# Altium project Temperature Sensor.PrjPcb (part 1 of 2)
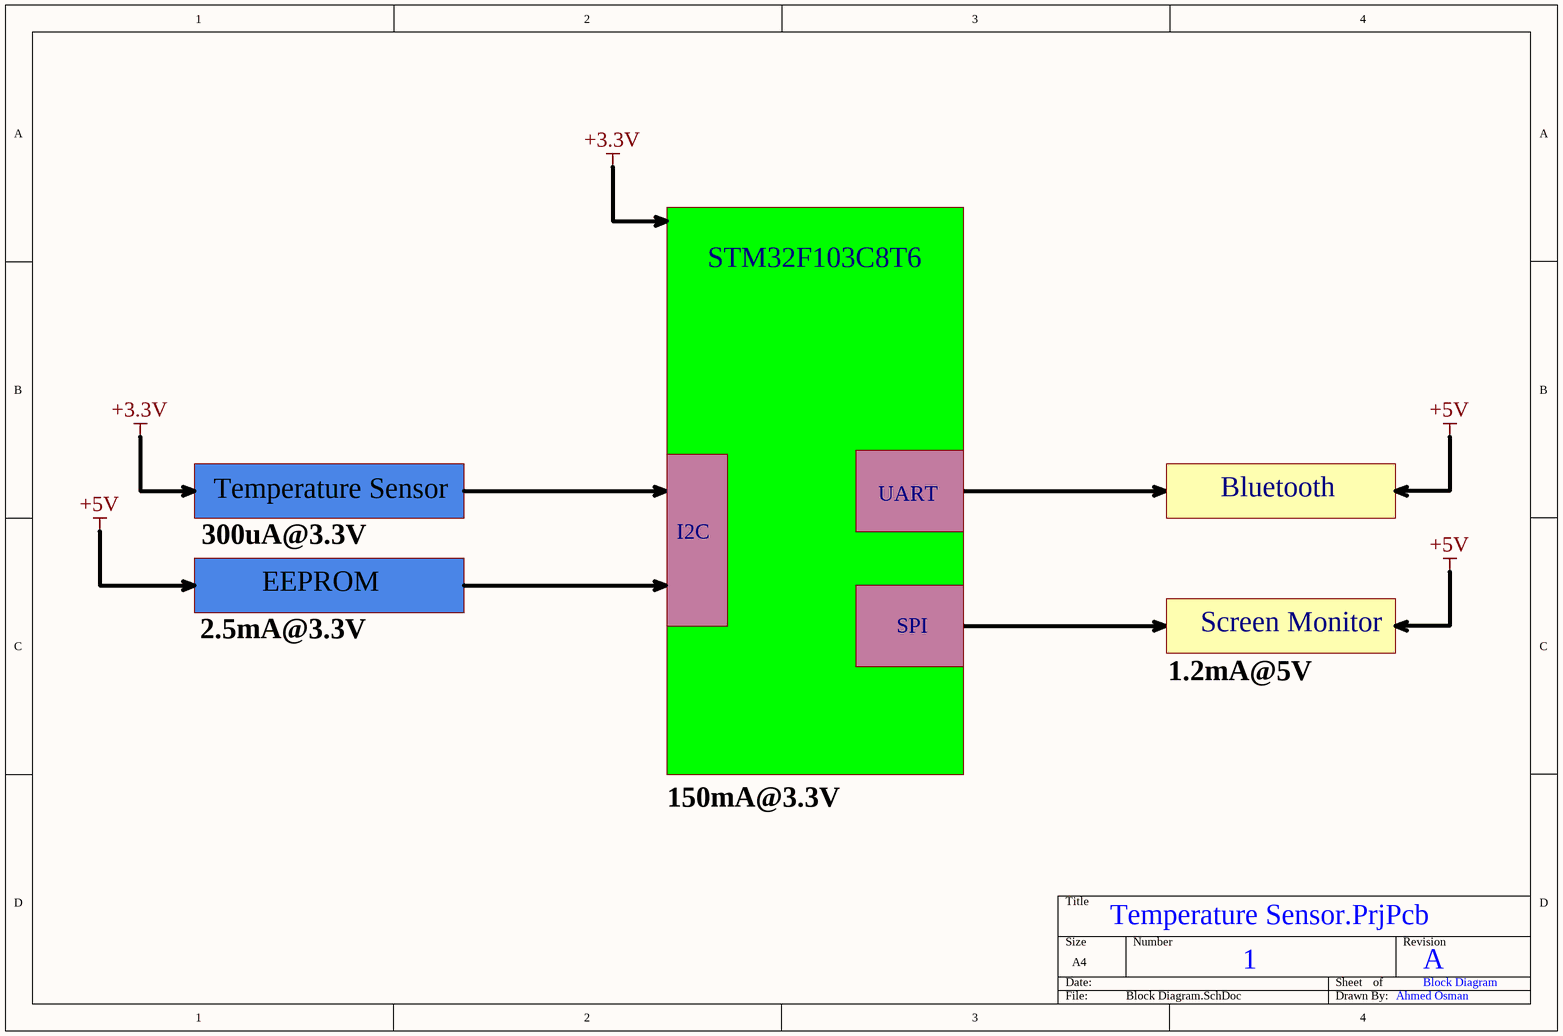
[diagram p0: Block Diagram.SchDoc]
Author: Ahmed Osman; Revision: A
6 sheets, 63 parts. Net scope: flat (ports and power ports of the same name join across sheets).
Board file: PCB.PcbDoc
Sheets:
  Block Diagram.SchDoc
  Power Conversion.SchDoc
  Buck Converter and LDO.SchDoc
  MCU_.SchDoc
  EEPROM and Temperature Sensor.SchDoc
  Bluetooth and OLED Display.SchDoc

## Sheet Block Diagram.SchDoc
size A4

### Notes on the sheet
- STM32F103C8T6
- Temperature Sensor
- UART
- Bluetooth
- 300uA@3.3V
- I2C
- 2.5mA@3.3V
- EEPROM
- SPI
- Screen Monitor
- 1.2mA@5V
- 150mA@3.3V
- 1
- A
- Block Diagram
- Ahmed Osman
- Labels drawn without touching a wire or pin: +3.3V, +5V

## Sheet Power Conversion.SchDoc
size A4
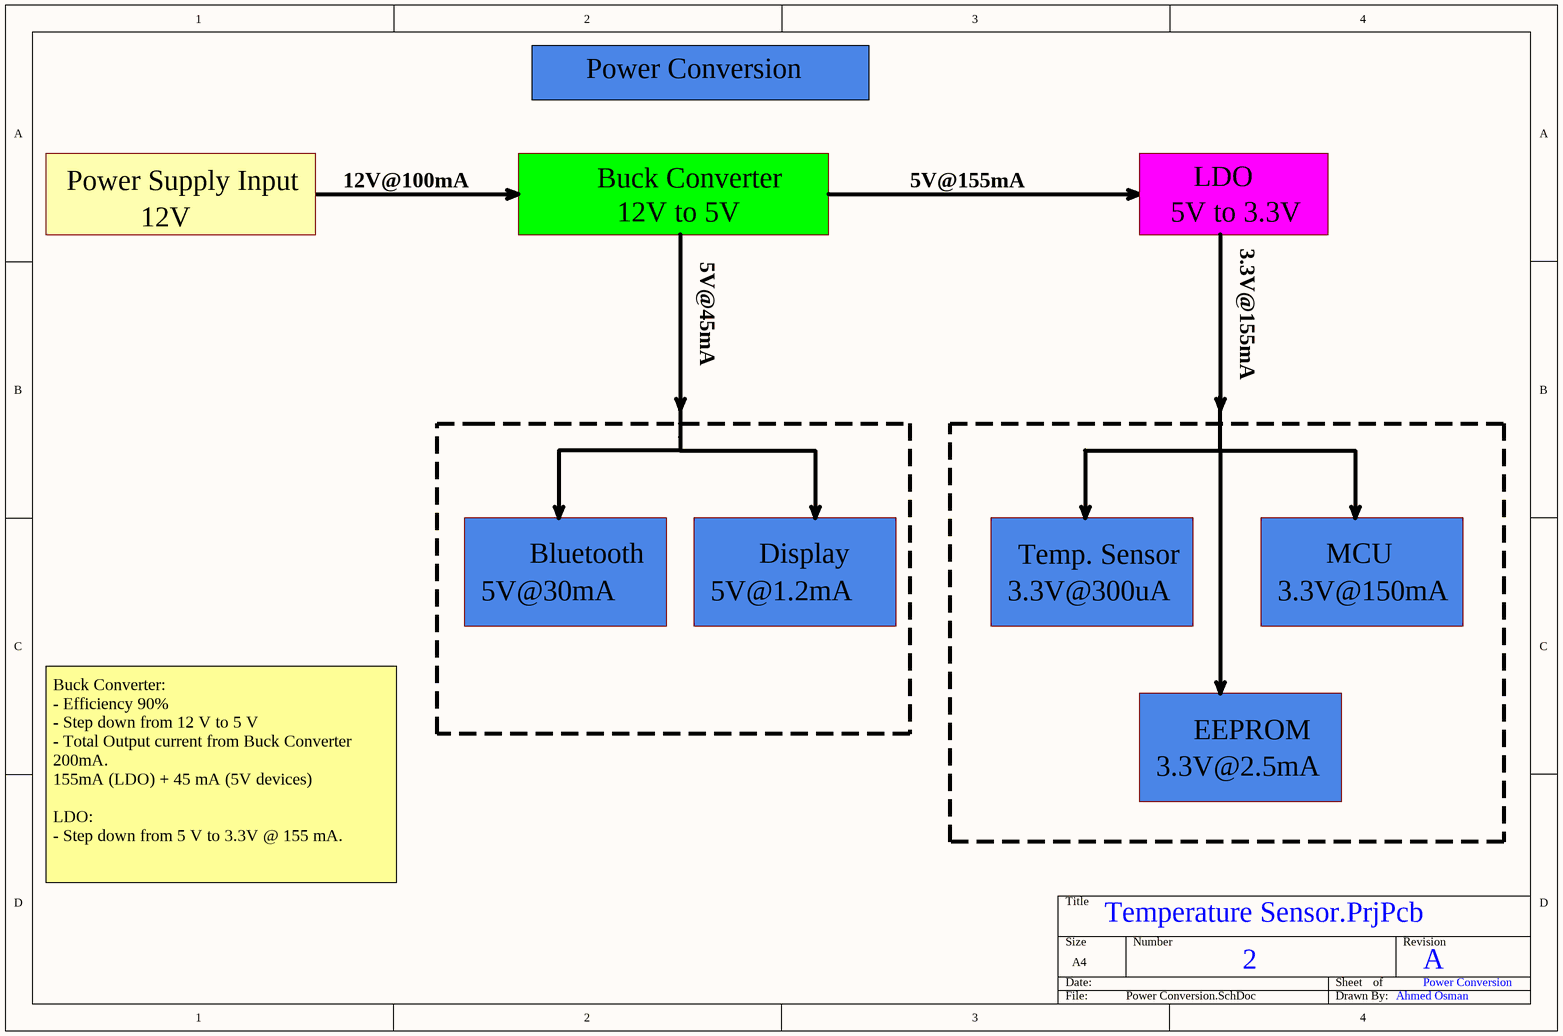
[diagram p1: Power Conversion.SchDoc]

### Notes on the sheet
- Power Conversion
- Power Supply Input
- 12V
- 12V@100mA
- Buck Converter
- 12V to 5V
- 5V@155mA
- 5V to 3.3V
- LDO
- 3.3V@155mA
- 5V@45mA
- Bluetooth
- Display
- Temp. Sensor
- MCU
- 5V@30mA
- 5V@1.2mA
- 3.3V@300uA
- 3.3V@150mA
- 3.3V@2.5mA
- EEPROM
- Buck Converter:
  - Efficiency 90%
  - Step down from 12 V to 5 V
  - Total Output current from Buck Converter 200mA.
  155mA (LDO) + 45 mA (5V devices)
  LDO:
  - Step down from 5 V to 3.3V @ 155 mA.
- 2
- A
- Ahmed Osman

## Sheet Buck Converter and LDO.SchDoc
size A4
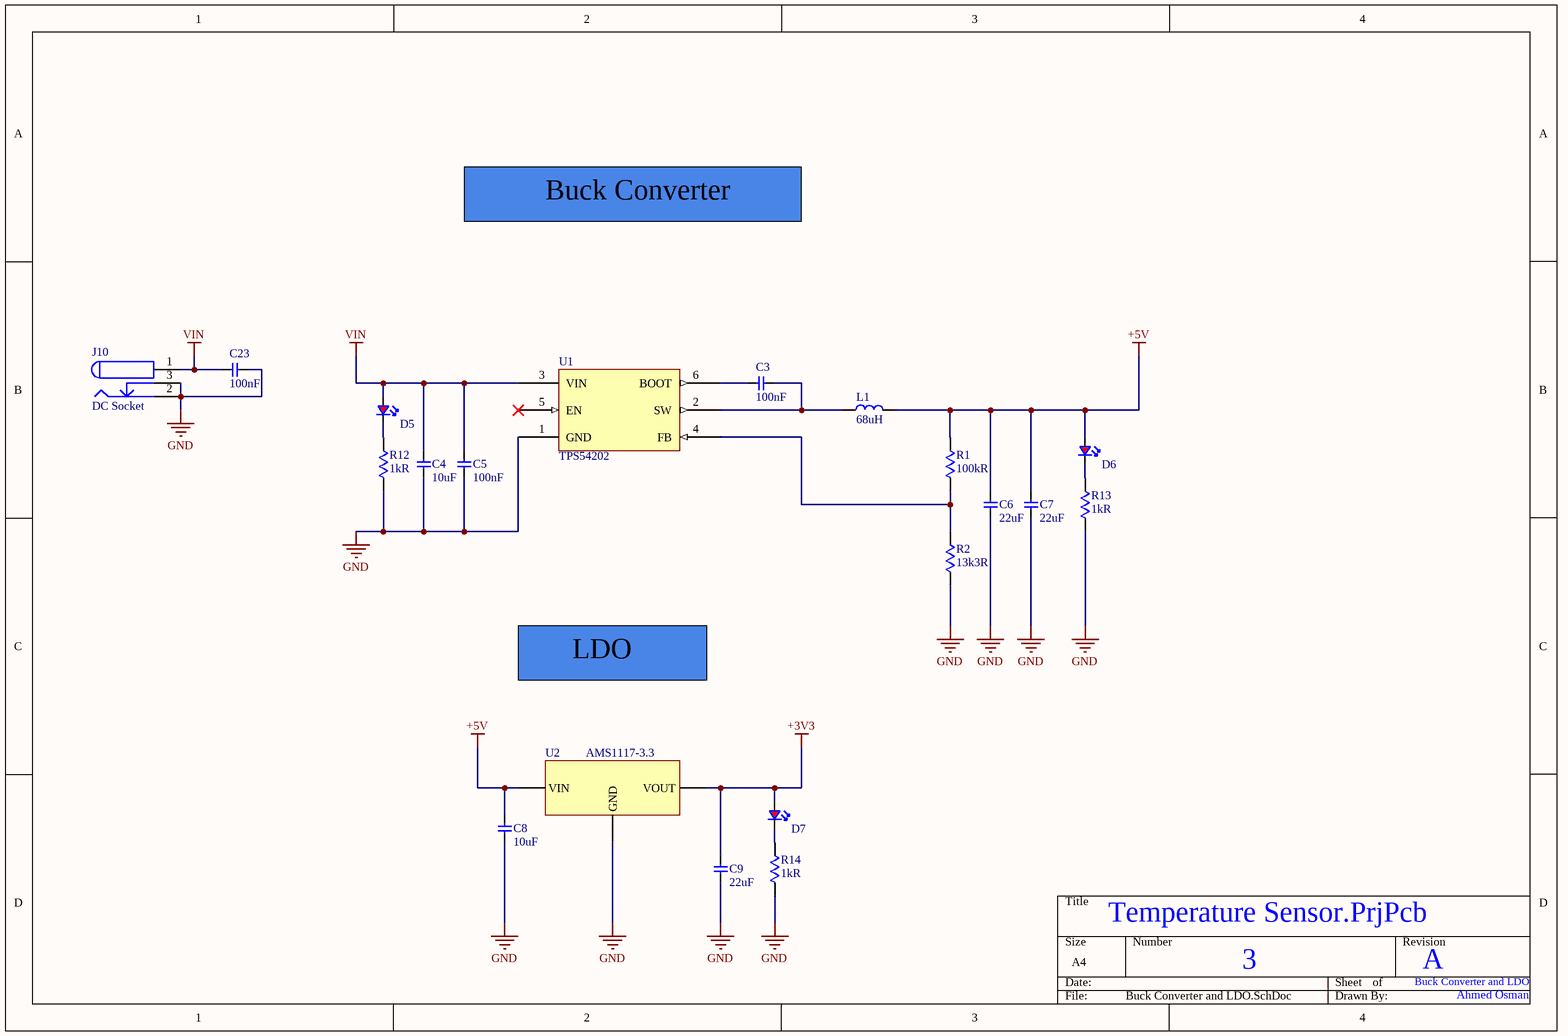
[diagram p2: Buck Converter and LDO.SchDoc]

### Parts
C3  100nF  [CAP 0603]
C4  10uF  [CAP 0603]
C5  100nF  [CAP 0603]
C6  22uF  [CAP 0603]
C7  22uF  [CAP 0603]
C8  10uF  [CAP 0603]
C9  22uF  [CAP 0603]
C23  100nF  [CAP 0603]
D5  LED RED  [LED RED]  (value not drawn)
D6  LED RED  [LED RED]  (value not drawn)
D7  LED RED  [LED RED]  (value not drawn)
J10  DC Socket  [DC Socket]
L1  68uH  [Inductor SMD,12.3x12.3mm]
R1  100kR  [RES 0603]
R2  13k3R  [RES 0603]
R12  1kR  [RES 0603]
R13  1kR  [RES 0603]
R14  1kR  [RES 0603]
U1  TPS54202  [SOT-23-6]
U2  AMS1117-3.3  [SOT-223-3L]

### Nets
+3V3: C9.2 D7.2 U2.2(VOUT)
+5V: C6.2 C7.2 C8.2 D6.2 L1.2 R1.2 U2.3(VIN)
GND: C4.2 C5.1 C6.1 C7.1 C8.1 C9.1 C23.2 J10.2(GND) J10.3(GND) R2.2 R12.1 R13.1 R14.1 U1.1(GND) U2.1(GND)
VIN: C4.1 C5.2 C23.1 D5.2 J10.1(VIN) U1.3(VIN)
NetC3_1: C3.1 U1.6(BOOT)
NetC3_2: C3.2 L1.1 U1.2(SW)
NetD5_1: D5.1 R12.2
NetD6_1: D6.1 R13.2
NetD7_1: D7.1 R14.2
NetR1_1: R1.1 R2.1 U1.4(FB)

Not connected (* = marked no-connect by the designer): U1 5(EN)*

### Notes on the sheet
- Buck Converter
- LDO
- 3
- Buck Converter and LDO
- A
- Ahmed Osman

### Library data of the parts
C3 C5 = CAP  0603 100nF 10% 50 V: 0.1 µF ±10% 50V Ceramic Capacitor X7R 0603 (1608 Metric); Manufacturer 1: Samsung; Manufacturer Part Number 1: CL10B104KB8NNNC; Supplier 1: Digikey; Stock 1: 6418947; Pricing 1: 4000 = 0.00562, 8000 = 0.00513, 12000 = 0.00489, 28000 = 0.00464, 100000 = 0.00336, 200000 = 0.00325, 400000 = 0.00306 (USD); RoHS: Yes; Mount: Surface Mount; Case/Package: 0603; Case Code (Metric): 1608; Case Code (Imperial): 0603; Material: Ceramic; Min Operating Temperature: -55°C; Max Operating Temperature: 125°C; Capacitance: 100nF; Tolerance: 10%; Dielectric: X7R; Voltage: 50V; Voltage Rating (DC): 50V; Voltage Rating: 50V; Package Quantity: 1; Packaging: Tape and Reel; Series: CL; Construction: Flat; Length: 1.6mm; Width: 0.031inch; Height: 0.8mm; Depth: 0.8mm; Thickness: 0.035inch; Radiation Hardening: No; Lead Free: Lead Free; RoHS Compliant: Yes; ComponentLink1URL: https://datasheet.ciiva.com/25803/cl10b104kb8nnnc-25803393.pdf?src-supplier=Digikey; ComponentLink1Description: https://datasheet.ciiva.com/25803/cl10b104kb8nnnc-25803393.pdf?src-supplier=Digikey; ComponentLink2URL: https://datasheet.ciiva.com/26838/getdatasheetpartid-89097-26838411.pdf?src-supplier=Verical; ComponentLink2Description: https://datasheet.ciiva.com/26838/getdatasheetpartid-89097-26838411.pdf?src-supplier=Verical; ComponentLink3URL: https://datasheet.ciiva.com/29198/456651-da-01-en-vs-kondensator-0605-29198839.pdf?src-supplier=Conrad; ComponentLink3Description: https://datasheet.ciiva.com/29198/456651-da-01-en-vs-kondensator-0605-29198839.pdf?src-supplier=Conrad; Supplier Part Number 1: 1276-1000-2-ND; value: 100nF; Manufacturer 2: Samsung; Manufacturer Part Number 2: CL10B104KB8NNNC; Supplier 2: LCSC; Supplier Part Number 2: C1591
C4 = CAP 0603 10 µF ±20% 35V _1: 10 µF ±20% 35V Ceramic Capacitor X5R 0603 (1608 Metric); Manufacturer: Murata; Manufacturer Part Number: GRM188R6YA106MA73D; Supplier 1: Digikey; Stock 1: 432618; Pricing 1: 1 = 0.3, 10 = 0.172, 50 = 0.123, 100 = 0.1077, 500 = 0.0818, 1000 = 0.07373 (USD); RoHS: Yes; Mount: Surface Mount; Case/Package: 0603; Case Code (Metric): 1608; Case Code (Imperial): 0603; Material: Ceramic; Min Operating Temperature: -55°C; Max Operating Temperature: 85°C; Packaging: Cut Tape; Capacitance: 10uF; Voltage Rating: 35V; Tolerance: 20%; Voltage Rating (DC): 35V; Dielectric: X5R; Series: GRM; Length: 0.063inch; Width: 0.031inch; Height: 1mm; Thickness: 0.039inch; RoHS Compliant: Yes; ComponentLink1URL: http://search.murata.co.jp/Ceramy/image/img/A01X/G101/ENG/GRM188R6YA106MA73-01.pdf?src-supplier=Digikey; ComponentLink1Description: http://search.murata.co.jp/Ceramy/image/img/A01X/G101/ENG/GRM188R6YA106MA73-01.pdf?src-supplier=Digikey; ComponentLink2URL: https://www.murata.com/~/media/webrenewal/support/library/catalog/products/capacitor/mlcc/c02e.ashx?la=en-us&src-supplier=Digikey; ComponentLink2Description: https://www.murata.com/~/media/webrenewal/support/library/catalog/products/capacitor/mlcc/c02e.ashx?la=en-us&src-supplier=Digikey; ComponentLink3URL: https://datasheet.octopart.com/GRM188R6YA106MA73D-Murata-datasheet-86813743.pdf?src-supplier=Future+Electronics; ComponentLink3Description: https://datasheet.octopart.com/GRM188R6YA106MA73D-Murata-datasheet-86813743.pdf?src-supplier=Future+Electronics; ComponentLink4URL: https://datasheet.octopart.com/GRM188R6YA106MA73D-Murata-datasheet-149523261.pdf?src-supplier=Newark; ComponentLink4Description: https://datasheet.octopart.com/GRM188R6YA106MA73D-Murata-datasheet-149523261.pdf?src-supplier=Newark; ComponentLink5URL: http://search.murata.co.jp/Ceramy/image/img/A01X/G101/ENG/GRM188R6YA106MA73-01.pdf?src-supplier=Mouser; ComponentLink5Description: http://search.murata.co.jp/Ceramy/image/img/A01X/G101/ENG/GRM188R6YA106MA73-01.pdf?src-supplier=Mouser; ComponentLink6URL: http://search.murata.co.jp/Ceramy/image/img/A01X/G101/ENG/GRM188R6YA106MA73-01.pdf?src-supplier=Future+Electronics; ComponentLink6Description: http://search.murata.co.jp/Ceramy/image/img/A01X/G101/ENG/GRM188R6YA106MA73-01.pdf?src-supplier=Future+Electronics; ComponentLink7URL: http://search.murata.co.jp/Ceramy/image/img/A01X/G101/ENG/GRM188R6YA106MA73-01.pdf?src-supplier=TTI; ComponentLink7Description: http://search.murata.co.jp/Ceramy/image/img/A01X/G101/ENG/GRM188R6YA106MA73-01.pdf?src-supplier=TTI; ComponentLink8URL: https://datasheet.octopart.com/GRM188R6YA106MA73D-Murata-datasheet-165579666.pdf?src-supplier=TME; ComponentLink8Description: https://datasheet.octopart.com/GRM188R6YA106MA73D-Murata-datasheet-165579666.pdf?src-supplier=TME; Supplier Part Number 1: 490-13248-1-ND; Supplier Part Number 2: C194427; Supplier 2: LCSC; value: 10uF
C6 C7 C9 = CAP  0603 22 µF ±20% 10V: 10V 22uF X5R ±20% 0603 Multilayer Ceramic Capacitors MLCC - SMD/SMT ROHS; Supplier 2: LCSC; Supplier Part Number 2: C86295; value: 22uF; Manufacturer 2: Samsung Electro-Mechanics; Manufacturer Part Number 2: CL10A226MP8NUNE
C8 = CAP 0603 10 µF ±20% 35V: 10 µF ±20% 35V Ceramic Capacitor X5R 0603 (1608 Metric); Manufacturer: Murata; Manufacturer Part Number: GRM188R6YA106MA73D; Supplier 1: Digikey; Stock 1: 432618; Pricing 1: 1 = 0.3, 10 = 0.172, 50 = 0.123, 100 = 0.1077, 500 = 0.0818, 1000 = 0.07373 (USD); RoHS: Yes; Mount: Surface Mount; Case/Package: 0603; Case Code (Metric): 1608; Case Code (Imperial): 0603; Material: Ceramic; Min Operating Temperature: -55°C; Max Operating Temperature: 85°C; Packaging: Cut Tape; Capacitance: 10uF; Voltage Rating: 35V; Tolerance: 20%; Voltage Rating (DC): 35V; Dielectric: X5R; Series: GRM; Length: 0.063inch; Width: 0.031inch; Height: 1mm; Thickness: 0.039inch; RoHS Compliant: Yes; ComponentLink1URL: http://search.murata.co.jp/Ceramy/image/img/A01X/G101/ENG/GRM188R6YA106MA73-01.pdf?src-supplier=Digikey; ComponentLink1Description: http://search.murata.co.jp/Ceramy/image/img/A01X/G101/ENG/GRM188R6YA106MA73-01.pdf?src-supplier=Digikey; ComponentLink2URL: https://www.murata.com/~/media/webrenewal/support/library/catalog/products/capacitor/mlcc/c02e.ashx?la=en-us&src-supplier=Digikey; ComponentLink2Description: https://www.murata.com/~/media/webrenewal/support/library/catalog/products/capacitor/mlcc/c02e.ashx?la=en-us&src-supplier=Digikey; ComponentLink3URL: https://datasheet.octopart.com/GRM188R6YA106MA73D-Murata-datasheet-86813743.pdf?src-supplier=Future+Electronics; ComponentLink3Description: https://datasheet.octopart.com/GRM188R6YA106MA73D-Murata-datasheet-86813743.pdf?src-supplier=Future+Electronics; ComponentLink4URL: https://datasheet.octopart.com/GRM188R6YA106MA73D-Murata-datasheet-149523261.pdf?src-supplier=Newark; ComponentLink4Description: https://datasheet.octopart.com/GRM188R6YA106MA73D-Murata-datasheet-149523261.pdf?src-supplier=Newark; ComponentLink5URL: http://search.murata.co.jp/Ceramy/image/img/A01X/G101/ENG/GRM188R6YA106MA73-01.pdf?src-supplier=Mouser; ComponentLink5Description: http://search.murata.co.jp/Ceramy/image/img/A01X/G101/ENG/GRM188R6YA106MA73-01.pdf?src-supplier=Mouser; ComponentLink6URL: http://search.murata.co.jp/Ceramy/image/img/A01X/G101/ENG/GRM188R6YA106MA73-01.pdf?src-supplier=Future+Electronics; ComponentLink6Description: http://search.murata.co.jp/Ceramy/image/img/A01X/G101/ENG/GRM188R6YA106MA73-01.pdf?src-supplier=Future+Electronics; ComponentLink7URL: http://search.murata.co.jp/Ceramy/image/img/A01X/G101/ENG/GRM188R6YA106MA73-01.pdf?src-supplier=TTI; ComponentLink7Description: http://search.murata.co.jp/Ceramy/image/img/A01X/G101/ENG/GRM188R6YA106MA73-01.pdf?src-supplier=TTI; ComponentLink8URL: https://datasheet.octopart.com/GRM188R6YA106MA73D-Murata-datasheet-165579666.pdf?src-supplier=TME; ComponentLink8Description: https://datasheet.octopart.com/GRM188R6YA106MA73D-Murata-datasheet-165579666.pdf?src-supplier=TME; Supplier Part Number 1: 490-13248-1-ND; Supplier Part Number 2: C194427; Supplier 2: LCSC; value: 10uF
C23 = CAP  0603 100 nF 10% 50 V: 0.1 µF ±10% 50V Ceramic Capacitor X7R 0603 (1608 Metric); Manufacturer 1: Samsung; Manufacturer Part Number 1: CL10B104KB8NNNC; Supplier 1: Digikey; Stock 1: 6418947; Pricing 1: 4000 = 0.00562, 8000 = 0.00513, 12000 = 0.00489, 28000 = 0.00464, 100000 = 0.00336, 200000 = 0.00325, 400000 = 0.00306 (USD); RoHS: Yes; Mount: Surface Mount; Case/Package: 0603; Case Code (Metric): 1608; Case Code (Imperial): 0603; Material: Ceramic; Min Operating Temperature: -55°C; Max Operating Temperature: 125°C; Capacitance: 100nF; Tolerance: 10%; Dielectric: X7R; Voltage: 50V; Voltage Rating (DC): 50V; Voltage Rating: 50V; Package Quantity: 1; Packaging: Tape and Reel; Series: CL; Construction: Flat; Length: 1.6mm; Width: 0.031inch; Height: 0.8mm; Depth: 0.8mm; Thickness: 0.035inch; Radiation Hardening: No; Lead Free: Lead Free; RoHS Compliant: Yes; ComponentLink1URL: https://datasheet.ciiva.com/25803/cl10b104kb8nnnc-25803393.pdf?src-supplier=Digikey; ComponentLink1Description: https://datasheet.ciiva.com/25803/cl10b104kb8nnnc-25803393.pdf?src-supplier=Digikey; ComponentLink2URL: https://datasheet.ciiva.com/26838/getdatasheetpartid-89097-26838411.pdf?src-supplier=Verical; ComponentLink2Description: https://datasheet.ciiva.com/26838/getdatasheetpartid-89097-26838411.pdf?src-supplier=Verical; ComponentLink3URL: https://datasheet.ciiva.com/29198/456651-da-01-en-vs-kondensator-0605-29198839.pdf?src-supplier=Conrad; ComponentLink3Description: https://datasheet.ciiva.com/29198/456651-da-01-en-vs-kondensator-0605-29198839.pdf?src-supplier=Conrad; Supplier Part Number 1: 1276-1000-2-ND; value: 100nF; Manufacturer 2: Samsung; Manufacturer Part Number 2: CL10B104KB8NNNC; Supplier 2: LCSC; Supplier Part Number 2: C1591
D5-D7 = LED RED: Red 625nm LED Indication - Discrete 2V 0603 (1608 Metric); Manufacturer 1: Wurth Electronics; Manufacturer Part Number 1: 150060RS75000; Lens Color: Colorless; Viewing Angle: 140°; Lens Style: Clear,Flat,Rectangular; Luminous Intensity: 250mcd; Forward Current: 30mA; Test Current: 20mA; Lens Transparency: Clear; Max Reverse Voltage (DC): 5V; Power Dissipation: 72mW; Lens Size: 0.7mm; Supplier 1: Digikey; Stock 1: 110901; Pricing 1: 1 = 0.15, 50 = 0.142, 100 = 0.122, 500 = 0.105, 1000 = 0.10125 (USD); RoHS: Yes; Mount: Surface Mount; Case/Package: 0603; Color: Red; Case Code (Metric): 1608; Case Code (Imperial): 0603; Min Operating Temperature: -40°C; Max Operating Temperature: 85°C; Package Quantity: 1; Packaging: Cut Tape; Forward Voltage: 2V; Wavelength: 625nm; Dominant Wavelength: 625nm; Series: WL-SMCW; Reverse Voltage: 5V; Length: 1.6mm; Width: 0.8mm; Height: 0.8mm; RoHS Compliant: Yes; Reach SVHC Compliant: Unknown; ComponentLink1URL: https://datasheet.ciiva.com/29563/150060rs75000-29563040.pdf?src-supplier=Digikey; ComponentLink1Description: https://datasheet.ciiva.com/29563/150060rs75000-29563040.pdf?src-supplier=Digikey; Supplier Part Number 1: 732-4978-1-ND; Supplier 2: LCSC; Supplier Part Number 2: C128251; Manufacturer 2: Everlight Elec; Manufacturer Part Number 2: 19-213/R6C-AN2Q1B/3T
J10 = DC Socket: Bend-in DC Power Receptacle -20℃~+70℃ 2.5mm 6.3mm 3A 30V Plugin DC Power Connectors ROHS; Supplier 2: LCSC; Supplier Part Number 2: C720558; Manufacturer 2: XUNPU; Manufacturer Part Number 2: DC-005-A250
L1 = IND  12.3x12.3mm 68uH ±20% 140mΩ_1: 2.1A 68uH ±20% 140mΩ SMD,12.3x12.3mm Inductors (SMD) ROHS; Manufacture: SHOU HAN; Manufacture Part Number: CYH127-68UH; Supplier 2: LCSC; Supplier Part Number 2: C2929504; value: 68uH
R1 = RES  0603 100KR 0.1% 1/10W: 100 kOhms ±0.1% 0.1W, 1/10W Chip Resistor 0603 (1608 Metric) Thin Film; Voltage Rating: 75V; Power Rating: 100mW; Temperature Coefficient: 25ppm/°C; Supplier 1: Digikey; Stock 1: 102412; Pricing 1: 1 = 0.14, 10 = 0.098, 50 = 0.0846, 100 = 0.0755, 500 = 0.0561, 1000 = 0.051 (USD); RoHS: Yes; Mount: Surface Mount; Case/Package: 0603; Case Code (Imperial): 0603; Case Code (Metric): 1608; Min Operating Temperature: -55°C; Max Operating Temperature: 155°C; Packaging: Tape and Reel; Tolerance: 0.1%; Resistance: 100kR; Package Quantity: 5000; Termination: SMD/SMT; Number of Terminations: 2; Max Power Dissipation: 100mW; Voltage Rating (DC): 75V; Features: Moisture Resistant; Series: RT; Technology: THIN FILM; Length: 0.063inch; Width: 0.031inch; Height: 0.022inch; Depth: 0.8mm; RoHS Compliant: Yes; Lead Free: 5697LeadFree; ComponentLink1URL: https://datasheet.ciiva.com/11819/0900766b8079c86e-11819622.pdf?src-supplier=Rs; ComponentLink1Description: https://datasheet.ciiva.com/11819/0900766b8079c86e-11819622.pdf?src-supplier=Rs; Supplier 2: LCSC; Supplier Part Number 2: C122538; Supplier Part Number 1: YAG1235CT-ND; value: 100kR; Manufacturer 2: Yageo; Manufacturer Part Number 2: RT0603BRD07100KL
R2 = RES  0603 13.3kR ±1% 0.1W: 13.3 kOhms ±1% 0.1W, 1/10W Chip Resistor 0603 (1608 Metric) Thin Film; Manufacturer: Yageo; Manufacturer Part Number 1: RT0603FRE0713K3L; Resistance: 13.3kR; Power Rating: 100mW; Voltage Rating: 75V; Temperature Coefficient: 50ppm/°C; Voltage Rating (DC): 50V; Supplier 1: Digikey; Stock 1: 26442; Pricing 1: 1 = 0.1, 10 = 0.018, 50 = 0.0158, 100 = 0.0128, 500 = 0.01224 (USD); RoHS: Yes; Case/Package: 0603; Case Code (Metric): 1608; Case Code (Imperial): 0603; Contact Plating: Tin,Matte; Min Operating Temperature: -55°C; Max Operating Temperature: 125°C; Package Quantity: 5000; Packaging: Tape and Reel; Tolerance: 1%; Number of Terminations: 2; Termination: SMD/SMT; Max Power Dissipation: 100mW; Series: RT; Length: 0.063inch; Width: 0.031inch; Height: 0.022inch; Lead Free: Lead Free; RoHS Compliant: Yes; ComponentLink1URL: https://datasheet.ciiva.com/2559/pyu-rt-1-to-0-05-rohs-l-5-2559525.pdf?src-supplier=Digikey; ComponentLink1Description: https://datasheet.ciiva.com/2559/pyu-rt-1-to-0-05-rohs-l-5-2559525.pdf?src-supplier=Digikey; ComponentLink2URL: https://datasheet.ciiva.com/8890/pyu-rt-1-to-0-05-rohs-l-4-8890911.pdf?src-supplier=Avnet; ComponentLink2Description: https://datasheet.ciiva.com/8890/pyu-rt-1-to-0-05-rohs-l-4-8890911.pdf?src-supplier=Avnet; ComponentLink3URL: https://datasheet.ciiva.com/12703/pyu-rt-1-to-0-05-rohs-l-4-12703147.pdf?src-supplier=Mouser; ComponentLink3Description: https://datasheet.ciiva.com/12703/pyu-rt-1-to-0-05-rohs-l-4-12703147.pdf?src-supplier=Mouser; value: 13k3R; Manufacturer Part Number 2: RT0603BRE0713K3L; Supplier 2: LCSC; Supplier Part Number 2: C861663; Supplier Part Number 1: 13-RT0603FRE0713K3LCT-ND
R12-R14 = RES  0603 1kR ±1% 0.1W: 1 kOhms ±1% 0.1W, 1/10W Chip Resistor 0603 (1608 Metric) Moisture Resistant Thick Film; Manufacturer: Yageo; Manufacturer Part Number 1: RC0603FR-071KL; Power Rating: 100mW; Voltage Rating: 50V; Temperature Coefficient: 100ppm/°C; ComponentLink5URL: http://www.yageo.com/documents/recent/PYu-RC_Group_51_RoHS_L_9.pdf?src-supplier=Arrow+Electronics; ComponentLink5Description: http://www.yageo.com/documents/recent/PYu-RC_Group_51_RoHS_L_9.pdf?src-supplier=Arrow+Electronics; ComponentLink6URL: https://datasheet.octopart.com/RC0603FR-0710KL-Yageo-datasheet-15599030.pdf?src-supplier=Future+Electronics; ComponentLink6Description: https://datasheet.octopart.com/RC0603FR-0710KL-Yageo-datasheet-15599030.pdf?src-supplier=Future+Electronics; Supplier 1: Future Electronics; Stock 1: 15835000; Pricing 1: 5000 = 0.0014, 50000 = 0.0014, 150000 = 0.0013, 375000 = 0.0013, 1000000 = 0.0012 (USD); RoHS: Yes; Case/Package: 0603; Case Code (Imperial): 0603; Case Code (Metric): 1608; Contact Plating: Tin,Matte; Min Operating Temperature: -55°C; Max Operating Temperature: 155°C; Tolerance: 1%; Resistance: 1kR; Packaging: Tape and Reel; Termination: SMD/SMT; Resistor Type: Thick Film; Features: Moisture Resistant; Series: RC; Max Power Dissipation: 100mW; Number of Terminations: 2; Resistance Tolerance: 1%; Construction: Rectangular; Technology: THICK FILM; Length: 1.6mm; Height: 0.45mm; Depth: 0.8mm; Reach SVHC Compliant: No; Military Standard: Not; Lead Free: Lead Free; RoHS Compliant: Yes; Supplier Part Number 1: 4016291; value: 1kR; Supplier 2: LCSC; Supplier Part Number 2: C728580; Manufacturer Part Number 2: RT0603BRB071KL
U1 = TPS54202: Buck Switching Regulator IC Positive Adjustable 0.596V 1 Output 2A SOT-23-6 Thin, TSOT-23-6; Switching Frequency: 500kHz; Number of Outputs: 1; Min Input Voltage: 4.5V; Max Input Voltage: 28V; Min Output Voltage: 596mV; Synchronous Rectifier: Yes; Quiescent Current: 40uA; Max Duty Cycle: 100%; Nominal Supply Current: 45uA; Supplier 1: Digikey; Stock 1: 1445; Pricing 1: 1 = 1.01, 10 = 0.726, 25 = 0.6548, 100 = 0.5771, 250 = 0.53996, 500 = 0.51758, 1000 = 0.49917 (USD); RoHS: Yes; Mount: Surface Mount; Case/Package: SOT-23-6; Number of Pins: 6; Min Operating Temperature: -40°C; Max Operating Temperature: 125°C; Output Current: 2A; Series: Eco-Mode™; Packaging: Tape and Reel; Max Output Voltage: 28V; Output Type: Adjustable; Output Configuration: Positive; Max Supply Voltage: 28V; Min Supply Voltage: 4.5V; Number of Channels: 1; Length: 2.9mm; Width: 1.6mm; Height: 1.1mm; Thickness: 870um; Lead Free: Lead Free; RoHS Compliant: Yes; ComponentLink1URL: http://www.ti.com/general/docs/suppproductinfo.tsp?distId=10&gotoUrl=http%3A%2F%2Fwww.ti.com%2Flit%2Fgpn%2Ftps54202&src-supplier=Digikey; ComponentLink1Description: http://www.ti.com/general/docs/suppproductinfo.tsp?distId=10&gotoUrl=http%3A%2F%2Fwww.ti.com%2Flit%2Fgpn%2Ftps54202&src-supplier=Digikey; ComponentLink2URL: http://www.ti.com/lit/ds/symlink/tps54202.pdf?src-supplier=Digikey; ComponentLink2Description: http://www.ti.com/lit/ds/symlink/tps54202.pdf?src-supplier=Digikey; ComponentLink3URL: http://www.ti.com/general/docs/suppproductinfo.tsp?distId=10&amp;gotoUrl=http%3A%2F%2Fwww.ti.com%2Flit%2Fgpn%2Ftps54202&src-supplier=Digikey; ComponentLink3Description: http://www.ti.com/general/docs/suppproductinfo.tsp?distId=10&amp;gotoUrl=http%3A%2F%2Fwww.ti.com%2Flit%2Fgpn%2Ftps54202&src-supplier=Digikey; Supplier 2: LCSC; Supplier Part Number 2: C191884; Supplier Part Number 1: 296-TPS54202DDCRCT-ND; Manufacturer 2: Texas Instruments; Manufacturer Part Number 2: TPS54202DDCR
U2 = AMS1117-3.3: Linear Voltage Regulator IC Positive Fixed 1 Output 1A SOT-223-3L; Supplier 1: Digikey; Stock 1: 4324; Pricing 1: 1 = 0.68, 10 = 0.407, 25 = 0.3352, 100 = 0.2538, 250 = 0.2138, 500 = 0.18916, 1000 = 0.16853 (USD); RoHS: No; Supplier 2: LCSC; Supplier Part Number 2: C347222; Supplier Part Number 1: 4518-AMS1117-3.3CT-ND; Manufacturer 2: UMW(Youtai Semiconductor Co., Ltd.); Manufacturer Part Number 2: AMS1117-3.3

## Sheet MCU_.SchDoc
size A4
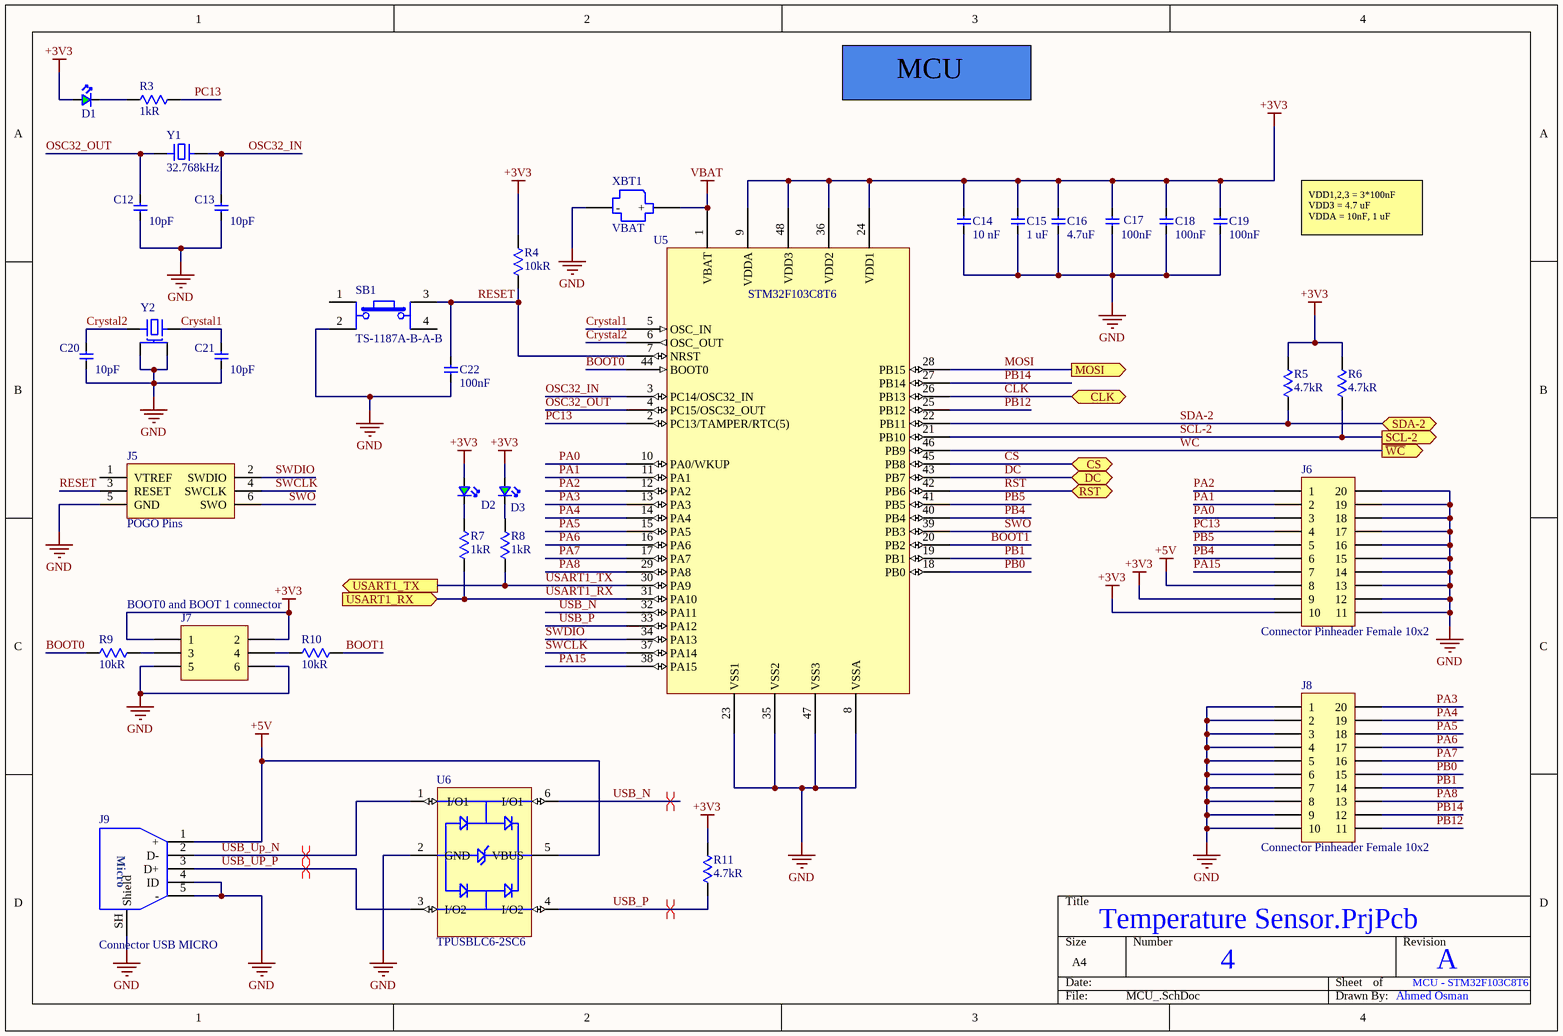
[diagram p3: MCU_.SchDoc]

### Parts
C12  10pF  [CAP 0603]
C13  10pF  [CAP 0603]
C14  10 nF  [CAP 0603]
C15  1 uF  [CAP 0603]
C16  4.7uF  [CAP 0603]
C17  100nF  [CAP 0603]
C18  100nF  [CAP 0603]
C19  100nF  [CAP 0603]
C20  10pF  [CAP 0603]
C21  10pF  [CAP 0603]
C22  100nF  [CAP 0603]
D1  LED GREEN  [LED GREEN]  (value not drawn)
D2  LED GREEN  [LED GREEN]  (value not drawn)
D3  LED GREEN  [LED GREEN]  (value not drawn)
J5  POGO Pins  [SEGGER_8.06.16_J-LINK_6-PIN_NEEDLE_ADAPTER]  (no BOM)
J6  Connector Pinheader Female 10x2  [Connector Pinheader 10x2]
J7  BOOT0 and BOOT 1 connector  [2X3 Female Pin Header Connector]
J8  Connector Pinheader Female 10x2  [Connector Pinheader 10x2]
J9  Connector USB MICRO  [Connector USB MICRO]
R3  1kR  [RES 0603]
R4  10kR  [RES 0603]
R5  4.7kR  [RES 0603]
R6  4.7kR  [RES 0603]
R7  1kR  [RES 0603]
R8  1kR  [RES 0603]
R9  10kR  [RES 0603]
R10  10kR  [RES 0603]
R11  4.7kR  [RES 0603]
SB1  TS-1187A-B-A-B  [Switch]
U5  STM32F103C8T6  [STM32F103C8T6]
U6  TPUSBLC6-2SC6  [SOT-23-6]
XBT1  VBAT  [Battery Holder VBAT]
Y1  32.768kHz  [SMD2012-2P]
Y2  Crystal 10pF ±10ppm ±15ppm SMD3225  [SMD3225-4P]  (value not drawn)

### Ports
CLK (bidir), CS (bidir), DC (bidir), MOSI (out), RST (bidir), SCL-2 (out), SDA-2 (bidir), USART1_RX (in), USART1_TX (out), ~{WC} (out)

### Nets
+3V3: C14.2 C15.2 C16.2 C17.2 C18.2 C19.2 D1.2 D2.2 D3.2 J6.9 J6.10 J7.1 J7.2 R4.2 R5.2 R6.2 R11.2 U5.9(VDDA) U5.24(VDD1) U5.36(VDD2) U5.48(VDD3)
+5V: J6.8 J9.1(+) U6.5(VBUS)
GND: C12.1 C13.1 C14.1 C15.1 C16.1 C17.1 C18.1 C19.1 C20.1 C21.1 C22.1 J5.5(GND) J6.11 J6.12 J6.13 J6.14 J6.15 J6.16 J6.17 J6.18 J6.19 J6.20 J7.5 J7.6 J8.1 J8.2 J8.3 J8.4 J8.5 J8.6 J8.7 J8.8 J8.9 J8.10 J9.4(ID) J9.5(-) J9.SH(Shield) SB1.2 U5.8(VSSA) U5.23(VSS1) U5.35(VSS2) U5.47(VSS3) U6.2(GND) XBT1.1(-) Y2.2(GND) Y2.4(GND)
VBAT: U5.1(VBAT) XBT1.2(+)
BOOT0: R9.1 U5.44(BOOT0)
BOOT1: R10.2 U5.20(PB2)
CLK: U5.26(PB13) ; port CLK
Crystal1: C21.2 U5.5(OSC_IN) Y2.3
Crystal2: C20.2 U5.6(OSC_OUT) Y2.1
CS: U5.45(PB8) ; port CS
DC: U5.43(PB7) ; port DC
MOSI: U5.28(PB15) ; port MOSI
OSC32_IN: C13.2 U5.3(PC14/OSC32_IN) Y1.2
OSC32_OUT: C12.2 U5.4(PC15/OSC32_OUT) Y1.1
PA0: J6.3 U5.10(PA0/WKUP)
PA1: J6.2 U5.11(PA1)
PA2: J6.1 U5.12(PA2)
PA3: J8.20 U5.13(PA3)
PA4: J8.19 U5.14(PA4)
PA5: J8.18 U5.15(PA5)
PA6: J8.17 U5.16(PA6)
PA7: J8.16 U5.17(PA7)
PA8: J8.13 U5.29(PA8)
PA15: J6.7 U5.38(PA15)
PB0: J8.15 U5.18(PB0)
PB1: J8.14 U5.19(PB1)
PB4: J6.6 U5.40(PB4)
PB5: J6.5 U5.41(PB5)
PB12: J8.11 U5.25(PB12)
PB14: J8.12 U5.27(PB14)
PC13: J6.4 R3.2 U5.2(PC13/TAMPER/RTC(5))
RESET: C22.2 J5.3(RESET) R4.1 SB1.3 U5.7(NRST)
RST: U5.42(PB6) ; port RST
SCL-2: R6.1 U5.21(PB10) ; port SCL-2
SDA-2: R5.1 U5.22(PB11) ; port SDA-2
SWCLK: J5.4(SWCLK) U5.37(PA14)
SWDIO: J5.2(SWDIO) U5.34(PA13)
SWO: J5.6(SWO) U5.39(PB3)
USART1_RX: R7.1 U5.31(PA10) ; port USART1_RX
USART1_TX: R8.1 U5.30(PA9) ; port USART1_TX
USB_N: U5.32(PA11) U6.6(I/O1)
USB_P: R11.1 U5.33(PA12) U6.4(I/O2)
USB_Up_N: J9.2(D-) U6.1(I/O1)
USB_UP_P: J9.3(D+) U6.3(I/O2)
~{WC}: U5.46(PB9) ; port ~{WC}
NetD1_1: D1.1 R3.1
NetD2_1: D2.1 R7.2
NetD3_1: D3.1 R8.2
NetJ7_3: J7.3 R9.2
NetJ7_4: J7.4 R10.1

Not connected (* = marked no-connect by the designer): J5 1(VTREF); SB1 1 4

### Layout directives
differential pair: USB_N, USB_P, USB_Up_N, USB_UP_P

### Notes on the sheet
- MCU
- VDD1,2,3 = 3*100nF
  VDD3 = 4.7 uF
  VDDA = 10nF, 1 uF
- 4
- MCU - STM32F103C8T6
- A
- Ahmed Osman
- (in symbol Connector USB MICRO) Micro

### Library data of the parts
C12 C13 C20 C21 = CAP  0603 10 pF ±5% 50V: 10 pF ±5% 50V Ceramic Capacitor C0G, NP0 0603 (1608 Metric); Temperature Coefficient: 30ppm/°C; Insulation Resistance: 100GR; value: 10pF; Supplier 1: Digikey; Stock 1: 267181; Pricing 1: 1 = 0.1, 10 = 0.03, 50 = 0.0204, 100 = 0.0173, 500 = 0.0123, 1000 = 0.01073 (USD); RoHS: Yes; Mount: Surface Mount; Case/Package: 0603; Number of Pins: 2; Case Code (Metric): 1608; Case Code (Imperial): 0603; Min Operating Temperature: -55°C; Max Operating Temperature: 125°C; Tolerance: 5%; Dielectric: C0G; Capacitance: 10pF; Voltage: 50V; Voltage Rating: 50V; Voltage Rating (DC): 50V; Packaging: Tape and Reel; Package Quantity: 4000; Termination: SMD/SMT; Series: CC; Length: 1.6mm; Width: 0.8mm; Height: 0.8mm; Depth: 0.8mm; Radiation Hardening: No; RoHS Compliant: Yes; Reach SVHC Compliant: No; Lead Free: Lead Free; Halogen Free: 5694HalogenFree; ComponentLink1URL: https://datasheet.ciiva.com/144/mlccorderingcode-144651.pdf?src-supplier=Digikey; ComponentLink1Description: https://datasheet.ciiva.com/144/mlccorderingcode-144651.pdf?src-supplier=Digikey; ComponentLink2URL: https://datasheet.ciiva.com/11786/0900766b8079c870-11786407.pdf?src-supplier=Rs; ComponentLink2Description: https://datasheet.ciiva.com/11786/0900766b8079c870-11786407.pdf?src-supplier=Rs; ComponentLink3URL: https://datasheet.ciiva.com/5789/1734582-5789616.pdf?src-supplier=Farnell; ComponentLink3Description: https://datasheet.ciiva.com/5789/1734582-5789616.pdf?src-supplier=Farnell; ComponentLink4URL: https://datasheet.ciiva.com/26862/getdatasheetpartid-403524-26862758.pdf?src-supplier=Verical; ComponentLink4Description: https://datasheet.ciiva.com/26862/getdatasheetpartid-403524-26862758.pdf?src-supplier=Verical; ComponentLink5URL: https://datasheet.ciiva.com/7978/1132289-7978126.pdf?src-supplier=Element14; ComponentLink5Description: https://datasheet.ciiva.com/7978/1132289-7978126.pdf?src-supplier=Element14; ComponentLink6URL: https://datasheet.ciiva.com/46430/1835847-46430150.pdf?src-supplier=Element14; ComponentLink6Description: https://datasheet.ciiva.com/46430/1835847-46430150.pdf?src-supplier=Element14; ComponentLink7URL: https://datasheet.ciiva.com/144/mlccorderingcode-144650.pdf?src-supplier=Digikey; ComponentLink7Description: https://datasheet.ciiva.com/144/mlccorderingcode-144650.pdf?src-supplier=Digikey; ComponentLink8URL: https://datasheet.ciiva.com/144/mlccorderingcode-144649.pdf?src-supplier=Digikey; ComponentLink8Description: https://datasheet.ciiva.com/144/mlccorderingcode-144649.pdf?src-supplier=Digikey; ComponentLink9URL: https://datasheet.ciiva.com/5425/upy-gp-np0-16v-to-50v-8-5425564.pdf?src-supplier=Mouser; ComponentLink9Description: https://datasheet.ciiva.com/5425/upy-gp-np0-16v-to-50v-8-5425564.pdf?src-supplier=Mouser; ComponentLink10URL: https://datasheet.ciiva.com/8033/1734582-8033710.pdf?src-supplier=Element14; ComponentLink10Description: https://datasheet.ciiva.com/8033/1734582-8033710.pdf?src-supplier=Element14; ComponentLink11URL: https://datasheet.ciiva.com/8033/1734582-8033706.pdf?src-supplier=Element14; ComponentLink11Description: https://datasheet.ciiva.com/8033/1734582-8033706.pdf?src-supplier=Element14; Supplier Part Number 1: 311-1058-1-ND; 1: *; Manufacturer 2: Yageo; Manufacturer Part Number 2: CC0603JRNPO9BN100; Supplier 2: LCSC; Supplier Part Number 2: C106245
C14 = CAP  0603 10 nF ±10% 25V: 10000 pF ±10% 25V Ceramic Capacitor X7R 0603 (1608 Metric); Supplier 1: Digikey; Stock 1: 28712; Pricing 1: 1 = 0.12, 10 = 0.068, 50 = 0.047, 100 = 0.0406, 500 = 0.02964, 1000 = 0.02625, 2500 = 0.02265, 5000 = 0.02047 (USD); RoHS: Yes; Supplier Part Number 1: 490-GCJ188R71E103KA01JCT-ND; Supplier 2: LCSC; value: 10 nF; Manufacturer 2: Murata; Manufacturer Part Number 2: GCJ188R71E103KA01J; Supplier Part Number 2: C17255079
C15 = CAP  0603 1 µF ±10% 25V: 1 µF ±10% 25V Ceramic Capacitor X5R 0603 (1608 Metric); Manufacturer: Yageo; Manufacturer Part Number 1: CC0603KRX5R8BB105; Material: 4241ConductorMaterial; Capacitance: 1uF; Supplier 1: Digikey; Stock 1: 2221073; Pricing 1: 1 = 0.1, 10 = 0.049, 50 = 0.0294, 100 = 0.0231, 500 = 0.01706, 1000 = 0.01413 (USD); RoHS: Yes; Mount: Surface Mount; Case/Package: 0603; Number of Pins: 2; Case Code (Metric): 1608; Case Code (Imperial): 0603; Min Operating Temperature: -55°C; Max Operating Temperature: 85°C; Tolerance: 10%; Dielectric: X5R; Voltage Rating: 25V; Packaging: Tape and Reel; Termination: SMD/SMT; Series: CC; Construction: Flat; Voltage Rating (DC): 25V; Length: 1.6mm; Height: 0.8mm; Depth: 0.8mm; Radiation Hardening: No; Reach SVHC Compliant: No; RoHS Compliant: Yes; Halogen Free: 5694HalogenFree; Lead Free: 5697LeadFree; ComponentLink1URL: https://datasheet.ciiva.com/7978/1525783-7978171.pdf?src-supplier=Element14; ComponentLink1Description: https://datasheet.ciiva.com/7978/1525783-7978171.pdf?src-supplier=Element14; ComponentLink2URL: https://datasheet.ciiva.com/176/mlccorderingcode-176786.pdf?src-supplier=Digikey; ComponentLink2Description: https://datasheet.ciiva.com/176/mlccorderingcode-176786.pdf?src-supplier=Digikey; ComponentLink3URL: https://datasheet.ciiva.com/176/mlccorderingcode-176785.pdf?src-supplier=Digikey; ComponentLink3Description: https://datasheet.ciiva.com/176/mlccorderingcode-176785.pdf?src-supplier=Digikey; ComponentLink4URL: https://datasheet.ciiva.com/176/mlccorderingcode-176787.pdf?src-supplier=Digikey; ComponentLink4Description: https://datasheet.ciiva.com/176/mlccorderingcode-176787.pdf?src-supplier=Digikey; ComponentLink5URL: https://datasheet.ciiva.com/11586/upy-gphc-x5r-4v-to-50v-12-11586318.pdf?src-supplier=Avnet; ComponentLink5Description: https://datasheet.ciiva.com/11586/upy-gphc-x5r-4v-to-50v-12-11586318.pdf?src-supplier=Avnet; value: 1 uF; Supplier 2: LCSC; Manufacturer Part Number 2: C14664; Supplier Part Number 1: 311-1445-1-ND; Supplier Part Number 2: C14664
C16 = CAP  0603 4.7 µF ±10% 35V: 4.7 µF ±10% 35V Ceramic Capacitor X5R 0603 (1608 Metric); Supplier 1: Digikey; Stock 1: 74456; Pricing 1: 1 = 0.3, 10 = 0.175, 50 = 0.125, 100 = 0.1095, 500 = 0.08322, 1000 = 0.07504 (USD); RoHS: Yes; Mount: Surface Mount; Case/Package: 0603; Case Code (Metric): 1608; Case Code (Imperial): 0603; Material: Ceramic; Weight: 0.000222oz; Min Operating Temperature: -55°C; Max Operating Temperature: 85°C; Capacitance: 4.7uF; Tolerance: 10%; Voltage Rating: 35V; Packaging: Tape and Reel; Package Quantity: 1; Dielectric: X5R; Voltage: 35V; Termination: SMD/SMT; Voltage Rating (DC): 35V; Series: GRM; Length: 1.6mm; Width: 0.8mm; Height: 0.8mm; Thickness: 0.031inch; Depth: 0.8mm; Reach SVHC Compliant: No; Lead Free: Lead Free; RoHS Compliant: Yes; ComponentLink1URL: https://datasheet.ciiva.com/46444/1769893-46444984.pdf?src-supplier=Element14; ComponentLink1Description: https://datasheet.ciiva.com/46444/1769893-46444984.pdf?src-supplier=Element14; ComponentLink2URL: https://datasheet.ciiva.com/46444/1769893-46444985.pdf?src-supplier=Element14; ComponentLink2Description: https://datasheet.ciiva.com/46444/1769893-46444985.pdf?src-supplier=Element14; ComponentLink3URL: https://datasheet.ciiva.com/14906/partnumbering-e-01-14906427.pdf?src-supplier=Digikey; ComponentLink3Description: https://datasheet.ciiva.com/14906/partnumbering-e-01-14906427.pdf?src-supplier=Digikey; ComponentLink4URL: https://datasheet.ciiva.com/14906/partnumbering-e-01-14906426.pdf?src-supplier=Digikey; ComponentLink4Description: https://datasheet.ciiva.com/14906/partnumbering-e-01-14906426.pdf?src-supplier=Digikey; ComponentLink5URL: https://datasheet.ciiva.com/14906/partnumbering-e-01-14906428.pdf?src-supplier=Digikey; ComponentLink5Description: https://datasheet.ciiva.com/14906/partnumbering-e-01-14906428.pdf?src-supplier=Digikey; value: 4.7uF; Supplier 2: LCSC; Supplier Part Number 2: C162274; Supplier Part Number 1: 490-7205-6-ND; Manufacturer 2: Murata; Manufacturer Part Number 2: GRM188R6YA475KE15D
C17-C19 = CAP  0603 100nF 10% 50 V: as C3 on sheet Buck Converter and LDO; Supplier 1: Digikey; Stock 1: 6418947; Pricing 1: 4000 = 0.00562, 8000 = 0.00513, 12000 = 0.00489, 28000 = 0.00464, 100000 = 0.00336, 200000 = 0.00325, 400000 = 0.00306 (USD); RoHS: Yes; Mount: Surface Mount; Case/Package: 0603; Case Code (Metric): 1608; Case Code (Imperial): 0603; Material: Ceramic; Min Operating Temperature: -55°C; Max Operating Temperature: 125°C; Capacitance: 100nF; Tolerance: 10%; Dielectric: X7R; Voltage: 50V; Voltage Rating (DC): 50V; Voltage Rating: 50V; Package Quantity: 1; Packaging: Tape and Reel; Series: CL; Construction: Flat; Length: 1.6mm; Width: 0.031inch; Height: 0.8mm; Depth: 0.8mm; Thickness: 0.035inch; Radiation Hardening: No; Lead Free: Lead Free; RoHS Compliant: Yes; ComponentLink1URL: https://datasheet.ciiva.com/25803/cl10b104kb8nnnc-25803393.pdf?src-supplier=Digikey; ComponentLink1Description: https://datasheet.ciiva.com/25803/cl10b104kb8nnnc-25803393.pdf?src-supplier=Digikey; ComponentLink2URL: https://datasheet.ciiva.com/26838/getdatasheetpartid-89097-26838411.pdf?src-supplier=Verical; ComponentLink2Description: https://datasheet.ciiva.com/26838/getdatasheetpartid-89097-26838411.pdf?src-supplier=Verical; ComponentLink3URL: https://datasheet.ciiva.com/29198/456651-da-01-en-vs-kondensator-0605-29198839.pdf?src-supplier=Conrad; ComponentLink3Description: https://datasheet.ciiva.com/29198/456651-da-01-en-vs-kondensator-0605-29198839.pdf?src-supplier=Conrad; Supplier Part Number 1: 1276-1000-2-ND; value: 100nF; Manufacturer 2: Samsung; Manufacturer Part Number 2: CL10B104KB8NNNC; Supplier 2: LCSC; Supplier Part Number 2: C1591
C22 = CAP  0603 100 nF 10% 50 V: as C23 on sheet Buck Converter and LDO; Supplier 1: Digikey; Stock 1: 6418947; Pricing 1: 4000 = 0.00562, 8000 = 0.00513, 12000 = 0.00489, 28000 = 0.00464, 100000 = 0.00336, 200000 = 0.00325, 400000 = 0.00306 (USD); RoHS: Yes; Mount: Surface Mount; Case/Package: 0603; Case Code (Metric): 1608; Case Code (Imperial): 0603; Material: Ceramic; Min Operating Temperature: -55°C; Max Operating Temperature: 125°C; Capacitance: 100nF; Tolerance: 10%; Dielectric: X7R; Voltage: 50V; Voltage Rating (DC): 50V; Voltage Rating: 50V; Package Quantity: 1; Packaging: Tape and Reel; Series: CL; Construction: Flat; Length: 1.6mm; Width: 0.031inch; Height: 0.8mm; Depth: 0.8mm; Thickness: 0.035inch; Radiation Hardening: No; Lead Free: Lead Free; RoHS Compliant: Yes; ComponentLink1URL: https://datasheet.ciiva.com/25803/cl10b104kb8nnnc-25803393.pdf?src-supplier=Digikey; ComponentLink1Description: https://datasheet.ciiva.com/25803/cl10b104kb8nnnc-25803393.pdf?src-supplier=Digikey; ComponentLink2URL: https://datasheet.ciiva.com/26838/getdatasheetpartid-89097-26838411.pdf?src-supplier=Verical; ComponentLink2Description: https://datasheet.ciiva.com/26838/getdatasheetpartid-89097-26838411.pdf?src-supplier=Verical; ComponentLink3URL: https://datasheet.ciiva.com/29198/456651-da-01-en-vs-kondensator-0605-29198839.pdf?src-supplier=Conrad; ComponentLink3Description: https://datasheet.ciiva.com/29198/456651-da-01-en-vs-kondensator-0605-29198839.pdf?src-supplier=Conrad; Supplier Part Number 1: 1276-1000-2-ND; value: 100nF; Manufacturer 2: Samsung; Manufacturer Part Number 2: CL10B104KB8NNNC; Supplier 2: LCSC; Supplier Part Number 2: C1591
D1-D3 = LED GREEN: Green 520nm LED Indication - Discrete 3.2V 0603 (1608 Metric); Manufacturer 1: Wurth Electronics; Manufacturer Part Number 1: 150060GS75000; Lens Color: Colorless; Viewing Angle: 140°; Lens Style: Clear,Flat,Rectangular; Luminous Intensity: 430mcd; Forward Current: 30mA; Test Current: 20mA; Lens Transparency: Clear; Max Reverse Voltage (DC): 5V; Output Current: 10uA; Power Dissipation: 105mW; Lens Size: 0.7mm; Supplier 1: Digikey; Stock 1: 149465; Pricing 1: 1 = 0.15, 50 = 0.142, 100 = 0.122, 500 = 0.105 (USD); RoHS: Yes; Mount: Surface Mount; Case/Package: 0603; Color: Green; Case Code (Metric): 1608; Case Code (Imperial): 0603; Min Operating Temperature: -40°C; Max Operating Temperature: 85°C; Wavelength: 520nm; Package Quantity: 1; Packaging: Cut Tape; Forward Voltage: 3.2V; Dominant Wavelength: 520nm; Series: WL-SMCW; Reverse Voltage: 5V; Length: 1.6mm; Width: 0.8mm; Height: 0.8mm; Lead Free: Lead Free; RoHS Compliant: Yes; Reach SVHC Compliant: Unknown; ComponentLink1URL: https://datasheet.ciiva.com/29562/150060gs75000-29562868.pdf?src-supplier=Digikey; ComponentLink1Description: https://datasheet.ciiva.com/29562/150060gs75000-29562868.pdf?src-supplier=Digikey; ComponentLink2URL: https://datasheet.ciiva.com/29279/759427-da-01-en-chipled-0603-w-kl-gruen-150060gs75000-29279201.pdf?src-supplier=Conrad; ComponentLink2Description: https://datasheet.ciiva.com/29279/759427-da-01-en-chipled-0603-w-kl-gruen-150060gs75000-29279201.pdf?src-supplier=Conrad; ComponentLink3URL: https://datasheet.ciiva.com/29562/150060gs75000-29562869.pdf?src-supplier=Digikey; ComponentLink3Description: https://datasheet.ciiva.com/29562/150060gs75000-29562869.pdf?src-supplier=Digikey; ComponentLink4URL: https://datasheet.ciiva.com/29562/150060gs75000-29562870.pdf?src-supplier=Digikey; ComponentLink4Description: https://datasheet.ciiva.com/29562/150060gs75000-29562870.pdf?src-supplier=Digikey; Supplier Part Number 1: 732-4971-1-ND; Supplier 2: LCSC; Supplier Part Number 2: C22371298; Manufacturer 2: HONGLITRONIC(Hongli Zhihui (HONGLITRONIC)); Manufacturer Part Number 2: PSC-1608U50GC-G4
J5 = POGO Pins: Plug-Of-Nails™ Cable Assembly
J6 J8 = Connector Pinheader Female 10x2: 20 Position Header Connector 0.100" (2.54mm) Through Hole Gold; Manufacturer: Sullins; Current Rating: 3A; Frequency: 100kHz; Max Output Current: -200mA; Max Supply Voltage: 16V; Min Supply Voltage: 4.5V; Supplier 1: Digikey; Stock 1: 44558; Pricing 1: 1 = 1.2, 10 = 0.98, 80 = 0.81475, 440 = 0.70043, 1000 = 0.6747 (USD); RoHS: Yes; Case/Package: 69Case; Contact Material: 150ConductorMaterial; Housing Material: 4239ConductorMaterial; Weight: 72.603129mg; Length: 4.9mm; Width: 3.91mm; Height: 1.58mm; Radiation Hardening: 5898YesNo; Lead Free: 5697LeadFree; Reach SVHC Compliant: 4186SVHC; RoHS Compliant: 5897YesNo; ComponentLink1URL: https://drawings-pdf.s3.amazonaws.com/10492.pdf?src-supplier=Digikey; ComponentLink1Description: https://drawings-pdf.s3.amazonaws.com/10492.pdf?src-supplier=Digikey; ComponentLink2URL: http://www.sullinscorp.com/catalogs/101_Page80-81_HEADER_.100_2.54mm_FEMALE.pdf?src-supplier=Future+Electronics; ComponentLink2Description: http://www.sullinscorp.com/catalogs/101_Page80-81_HEADER_.100_2.54mm_FEMALE.pdf?src-supplier=Future+Electronics; ComponentLink3URL: https://datasheet.octopart.com/PPPC102LFBN-RC-Sullins-datasheet-41308905.pdf?src-supplier=Future+Electronics; ComponentLink3Description: https://datasheet.octopart.com/PPPC102LFBN-RC-Sullins-datasheet-41308905.pdf?src-supplier=Future+Electronics; Supplier Part Number 1: S6106-ND; Manufacturer Part Number 2: PPPC102LFBN-RC; Supplier 2: LCSC; Supplier Part Number 2: C5845310
J7 = BOOT0 and BOOT 1 connector: 2.54mm 2.54mm Double Row 2.5A 6P -40℃~+105℃ Direct Insert 2x3P Top 8.5mm Square Hole Plugin,P=2.54mm Female Headers ROHS; Supplier 2: LCSC; Supplier Part Number 2: C5116527; Manufacturer 2: ZHOURI; Manufacturer Part Number 2: PM2.54-2*3
J9 = Connector USB MICRO: 1.8A USB 2.0 1 Horizontal attachment 5P Mother -20℃~+85℃ Micro-B SMD USB Connectors ROHS; Supplier 2: LCSC; Supplier Part Number 2: C404969; Manufacturer 2: SHOU HAN; Manufacturer Part Number 2: MicroXNJ
R3 R7 R8 = RES  0603 1kR ±1% 0.1W: as R12 on sheet Buck Converter and LDO; ComponentLink5URL: http://www.yageo.com/documents/recent/PYu-RC_Group_51_RoHS_L_9.pdf?src-supplier=Arrow+Electronics; ComponentLink5Description: http://www.yageo.com/documents/recent/PYu-RC_Group_51_RoHS_L_9.pdf?src-supplier=Arrow+Electronics; ComponentLink6URL: https://datasheet.octopart.com/RC0603FR-0710KL-Yageo-datasheet-15599030.pdf?src-supplier=Future+Electronics; ComponentLink6Description: https://datasheet.octopart.com/RC0603FR-0710KL-Yageo-datasheet-15599030.pdf?src-supplier=Future+Electronics; Supplier 1: Future Electronics; Stock 1: 15835000; Pricing 1: 5000 = 0.0014, 50000 = 0.0014, 150000 = 0.0013, 375000 = 0.0013, 1000000 = 0.0012 (USD); RoHS: Yes; Case/Package: 0603; Case Code (Imperial): 0603; Case Code (Metric): 1608; Contact Plating: Tin,Matte; Min Operating Temperature: -55°C; Max Operating Temperature: 155°C; Tolerance: 1%; Resistance: 1kR; Packaging: Tape and Reel; Termination: SMD/SMT; Resistor Type: Thick Film; Features: Moisture Resistant; Series: RC; Max Power Dissipation: 100mW; Number of Terminations: 2; Resistance Tolerance: 1%; Construction: Rectangular; Technology: THICK FILM; Length: 1.6mm; Height: 0.45mm; Depth: 0.8mm; Reach SVHC Compliant: No; Military Standard: Not; Lead Free: Lead Free; RoHS Compliant: Yes; Supplier Part Number 1: 4016291; value: 1kR; Supplier 2: LCSC; Supplier Part Number 2: C728580; Manufacturer Part Number 2: RT0603BRB071KL
R4 R9 R10 = RES  0603 10KR ±1% 0.1W, 1/10W: 10 kOhms ±1% 0.1W, 1/10W Chip Resistor 0603 (1608 Metric) Moisture Resistant Thick Film; Temperature Coefficient: 100ppm/°C; Voltage Rating (DC): 50V; Voltage Rating: 75V; Power Rating: 100mW; Supplier 1: Digikey; Stock 1: 5660971; Pricing 1: 1 = 0.1, 10 = 0.012, 50 = 0.0096, 100 = 0.0071, 500 = 0.00662, 1000 = 0.00612 (USD); RoHS: Yes; Case/Package: 0603; Number of Pins: 2; Case Code (Imperial): 0603; Case Code (Metric): 1608; Size Code: 0603; Weight: 7.1E-05oz; Min Operating Temperature: -55°C; Max Operating Temperature: 155°C; Resistance: 10kR; Tolerance: 1%; Packaging: Tape and Reel; Termination: SMD/SMT; Resistor Type: Thick Film; Features: Moisture Resistant; Series: RC; Max Power Dissipation: 100mW; Number of Terminations: 2; Resistance Tolerance: 1%; Construction: Rectangular; Length: 1.6mm; Width: 0.8mm; Height: 0.45mm; Depth: 0.8mm; Lead Pitch: 0.3mm; Reach SVHC Compliant: No; Lead Free: 5697LeadFree; Military Standard: Not; RoHS Compliant: Yes; ComponentLink1URL: https://datasheet.ciiva.com/7660/38590-7660789.pdf?src-supplier=Element14; ComponentLink1Description: https://datasheet.ciiva.com/7660/38590-7660789.pdf?src-supplier=Element14; value: 10kR; Supplier 2: LCSC; Supplier Part Number 2: C98220; Supplier Part Number 1: 311-10.0KHRCT-ND; Manufacturer 2: Yageo; Manufacturer Part Number 2: RC0603FR-0710KL
R5 R6 R11 = RES  0603 4.7 kOhms ±1% 0.1W, 1/10W: 4.7 kOhms ±1% 0.1W, 1/10W Chip Resistor 0603 (1608 Metric) Moisture Resistant Thick Film; Power Rating: 100mW; Voltage Rating (DC): 50V; Temperature Coefficient: 100ppm/°C; Supplier 1: Digikey; Stock 1: 637732; Pricing 1: 1 = 0.1, 10 = 0.012, 50 = 0.0096, 100 = 0.0071, 500 = 0.00612, 1000 = 0.0051 (USD); RoHS: Yes; Case/Package: 0603; Number of Pins: 2; Case Code (Imperial): 0603; Case Code (Metric): 1608; Size Code: 0603; Min Operating Temperature: -55°C; Max Operating Temperature: 155°C; Tolerance: 1%; Resistor Type: Thick Film; Resistance: 4.7kR; Packaging: Tape and Reel; Voltage Rating: 50V; Termination: SMD/SMT; Features: Moisture Resistant; Series: RC; Max Power Dissipation: 100mW; Number of Terminations: 2; Construction: Rectangular; Resistance Tolerance: 1%; Length: 1.6mm; Width: 0.8mm; Depth: 0.8mm; Lead Pitch: 0.3mm; RoHS Compliant: Yes; Reach SVHC Compliant: Unknown; Lead Free: 5697LeadFree; Military Standard: Not; ComponentLink1URL: https://datasheet.ciiva.com/15189/getdatasheetpartid-422754-15189760.pdf?src-supplier=Verical; ComponentLink1Description: https://datasheet.ciiva.com/15189/getdatasheetpartid-422754-15189760.pdf?src-supplier=Verical; ComponentLink2URL: https://datasheet.ciiva.com/7660/38590-7660794.pdf?src-supplier=Element14; ComponentLink2Description: https://datasheet.ciiva.com/7660/38590-7660794.pdf?src-supplier=Element14; ComponentLink3URL: https://datasheet.ciiva.com/22747/443971-22747528.pdf?src-supplier=Element14; ComponentLink3Description: https://datasheet.ciiva.com/22747/443971-22747528.pdf?src-supplier=Element14; ComponentLink4URL: https://datasheet.ciiva.com/46440/1868787-46440909.pdf?src-supplier=Element14; ComponentLink4Description: https://datasheet.ciiva.com/46440/1868787-46440909.pdf?src-supplier=Element14; ComponentLink5URL: https://datasheet.ciiva.com/7746/1868787-7746365.pdf?src-supplier=Element14; ComponentLink5Description: https://datasheet.ciiva.com/7746/1868787-7746365.pdf?src-supplier=Element14; ComponentLink6URL: https://datasheet.ciiva.com/7746/1738695-7746366.pdf?src-supplier=Element14; ComponentLink6Description: https://datasheet.ciiva.com/7746/1738695-7746366.pdf?src-supplier=Element14; value: 4.7kR; Supplier 2: LCSC; Supplier Part Number 2: C99782; Supplier Part Number 1: 311-4.70KHRCT-ND; Manufacturer 2: Yageo; Manufacturer Part Number 2: RC0603FR-074K7L
SB1 = TS-1187A-B-A-B: None Without 50mA 5.1mm 100000 Times 160gf 12V 5.1mm 1.5mm Round Button Standing paste SPST SMD Tactile Switches ROHS; Supplier 2: LCSC; Supplier Part Number 2: C318884; Manufacturer 2: XKB Connection; Manufacturer Part Number 2: TS-1187A-B-A-B
U5 = STM32F103C8T6: ARM® Cortex®-M3 STM32F1 Microcontroller IC 32-Bit Single-Core 72MHz 64KB (64K x 8) FLASH; RAM Size: 20KB; Interface: I2C,SPI,USB,CAN,USART; Number of I/Os: 37; Number of Timers/Counters: 3; Max Supply Voltage: 3.6V; Number of ADC Channels: 10; Min Supply Voltage: 2V; Data Bus Width: 32b; Core Architecture: ARM; Nominal Supply Current: 1.7uA; Number of A/D Converters: 2; Supplier 1: Digikey; Stock 1: 8973; Pricing 1: 1 = 6.11, 10 = 5.522, 25 = 5.2652, 80 = 4.57163, 250 = 4.36616, 500 = 3.9809, 1000 = 3.46724, 2500 = 3.33883 (USD); RoHS: Yes; Case/Package: LQFP; Number of Pins: 48; Weight: 0.006349oz; Min Operating Temperature: -40°C; Max Operating Temperature: 85°C; Package Quantity: 1500; Packaging: Tray; Memory Type: FLASH; Max Frequency: 72MHz; Memory Size: 64KB; Series: STM32F103C8; Number of Channels: 10; Length: 7mm; Width: 7mm; Height: 1.4mm; Lead Free: Lead Free; RoHS Compliant: Yes; ComponentLink1URL: https://datasheet.ciiva.com/14100/pustm-arm-microcont-stm32f103-en-14100508.pdf?src-supplier=Distrelec; ComponentLink1Description: https://datasheet.ciiva.com/14100/pustm-arm-microcont-stm32f103-en-14100508.pdf?src-supplier=Distrelec; Supplier 2: LCSC; Supplier Part Number 2: C8734; Supplier Part Number 1: 497-6063-ND; Manufacturer 2: STMicroelectronics; Manufacturer Part Number 2: STM32F103C8T6
U6 = TPUSBLC6-2SC6: SOT-23-6 ESD and Surge Protection (TVS/ESD) ROHS; Manufacturer 2: TECH PUBLIC; Manufacturer Part Number 2: TPUSBLC6-2SC6; Supplier 2: LCSC; Supplier Part Number 2: C558442
XBT1 = VBAT: Battery holder CR2032 SMD Button And Strip Battery Connector ROHS; Supplier 2: LCSC; ComponentLink1Description: Link; ComponentLink1URL: https://www.lcsc.com/product-detail/Button-And-Strip-span-style-background-color-ff0-Battery-span-Connector_Q-J-CR2032-BS-6-1_C70377.html; Manufacturer 2: Q&J; Manufacturer Part Number 2: CR2032-BS-6-1; Supplier Part Number 2: C70377
Y1 = Crystal 32.768kHz: 32.768kHz Surface Mount Crystal 7pF ±20ppm SMD2012-2P Crystals ROHS; Supplier 2: LCSC; Supplier Part Number 2: C99009; Manufacturer 2: Seiko Epson; Manufacturer Part NUmber 2: X1A0000610006
Y2 = Crystal 10pF ±10ppm ±15ppm SMD3225: 8MHz Surface Mount Crystal 10pF ±10ppm ±15ppm SMD3225-4P Crystals ROHS; Supplier Part Number 2: C400090; Manufacturer 2: Yajingxin; Manufacturer Part Number 2: TAXM8M4RDBCCT2T; Supplier 2: LCSC